# Altium project Steering.PrjPcb (part 2 of 2)

## Sheet Neopixel.SchDoc: =DocumentName
size A4; Organization: Queen's Formula SAE; Address1: 130 Stuart St, Kingston; Address2: Ontario; Address3: Canada; Address4: K7L 2V9; DocumentNumber: 1; Revision: 0; SheetNumber: 1; SheetTotal: 1
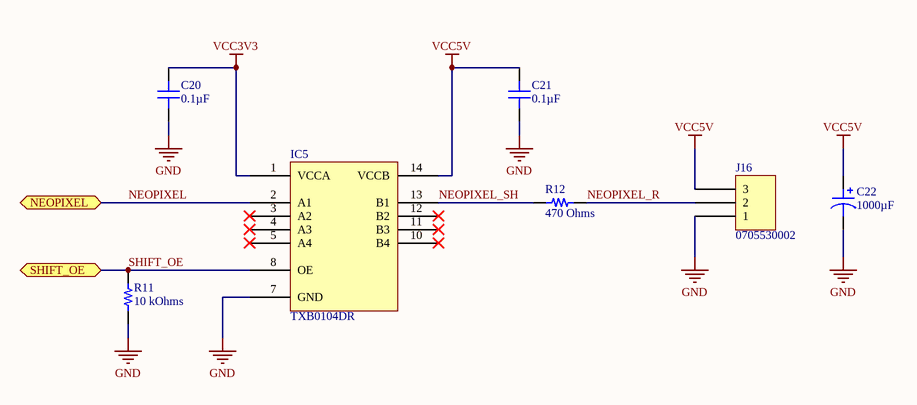
[diagram p5: Neopixel.SchDoc]

### Parts
C20  0.1µF  [CAP 0402_1005]
C21  0.1µF  [CAP 0402_1005]
C22  1000µF  [CAP ALSMD 8.3MM H10.5MM]
IC5  TXB0104DR  [TI SOIC-14 D]
J16  0705530002  [MOLEX SDA-70553-3PIN]
R11  10 kOhms  [RES 0402_1005]
R12  470 Ohms  [RES 0402_1005]

### Ports
NEOPIXEL (bidir), SHIFT_OE (bidir)

### Nets
GND: C20.1 C21.1 C22.2 IC5.7(GND) J16.1 R11.1
VCC3V3: C20.2 IC5.1(VCCA)
VCC5V: C21.2 C22.1 IC5.14(VCCB) J16.3
NEOPIXEL: IC5.2(A1) ; port NEOPIXEL
NEOPIXEL_R: J16.2 R12.2
NEOPIXEL_SH: IC5.13(B1) R12.1
SHIFT_OE: IC5.8(OE) R11.2 ; port SHIFT_OE

Not connected (* = marked no-connect by the designer): IC5 3(A2)* 4(A3)* 5(A4)* 10(B4)* 11(B3)* 12(B2)*

### Notes on the sheet
- Title
- Size:
- Date:
- A4
- Number:
- Time:
- Revision:
- Sheet
- of
- File:

### Library data of the parts
C20 C21 = C0402C104K4RECAUTO: CAP CER 0402 0.1UF 16V X7R 10%; Manufacturer: KEMET; Part Number: C0402C104K4RECAUTO; Value: 0.1µF; Applications: Automotive, ESD Protection; Capacitance: 0.1µF; ComponentLink1Description: Datasheet; ComponentLink1URL: https://api.kemet.com/component-edge/download/datasheet/C0402C104K4RECAUTO.pdf; ComponentLink2Description: DigiKey Link; ComponentLink2URL: http://digikey.com/product-detail/en/kemet/C0402C104K4RECAUTO/399-17167-1-ND/8563708; Device Package: 0402 (1005 Metric); LastUpdated: 2020-09-02 1:02:25 AM; Lifecycle Status: Active; Minimum Order: 1; Mounting Type: Surface Mount, MLCC; Operating Temperature: -55°C ~ 125°C; Package / Case: 0402 (1005 Metric); Packaging: TapeAndReel; PartId: 1731; Part Status: Active; Price: 0.02; Series: ESD SMD Auto X7R; Size / Dimension: 0.039" L x 0.020" W (1.00mm x 0.50mm); Supplier 1: DigiKey; Supplier Part Number 1: 399-17167-1-ND; Temperature Coefficient: X7R; Thickness (Max): 0.022" (0.55mm); Tolerance: ±10%; Voltage - Rated: 16V; Ratings: AEC-Q200
C22 = EEE-FT1A102AP: CAP ALUM 1000UF 20% 10V SMD; Manufacturer: Panasonic Electronic Components; ESR (Equivalent Series Resistance): 80mOhm @ 100kHz; Lifetime @ Temp.: 2000 Hrs @ 105°C; Polarization: Polar; Ripple Current @ High Frequency: 850mA @ 100kHz; Ripple Current @ Low Frequency: 595mA @ 120Hz; Surface Mount Land Size: 0.327" L x 0.327" W (8.30mm x 8.30mm); Part Number: EEE-FT1A102AP; Applications: Automotive; Capacitance: 1000µF; ComponentLink1Description: Datasheet; ComponentLink1URL: https://na.industrial.panasonic.com/file-download/3112; ComponentLink2Description: DigiKey Link; ComponentLink2URL: http://digikey.com/product-detail/en/panasonic-electronic-components/EEE-FT1A102AP/P15081CT-ND/2796921; Device Package: Radial, Can - SMD; Height - Seated (Max): 0.413" (10.50mm); LastUpdated: 2020-09-02 1:25:16 AM; Lifecycle Status: Active; Minimum Order: 1; Mounting Type: Surface Mount; Operating Temperature: -55°C ~ 105°C; Package / Case: Radial, Can - SMD; Packaging: TapeAndReel; PartId: 7500; Part Status: Active; Price: 0.33; Ratings: AEC-Q200; Series: FT; Size / Dimension: 0.315" Dia (8.00mm); Supplier 1: DigiKey; Supplier Part Number 1: P15081CT-ND; Tolerance: ±20%; Value: 1000µF; Voltage - Rated: 10V
IC5 = TXB0104DR: IC TRNSLTR BIDIRECTIONAL 14SOIC; Part Number: TXB0104DR
J16 = 0705530002: CONN HEADER R/A 3POS 2.54MM; Manufacturer: Molex; Contact Length - Mating: 0.240" (6.10mm); Contact Length - Post: 0.130" (3.30mm); Material Flammability Rating: UL94 V-0; Number of Positions: 3; Number of Positions Loaded: All; Pitch - Mating: 0.100" (2.54mm); Shrouding: Shrouded - 4 Wall; Style: Board to Cable/Wire; Voltage Rating: 250V; Part Number: 0705530002; ComponentLink1Description: Datasheet; ComponentLink1URL: https://www.molex.com/pdm_docs/sd/705530002_sd.pdf; ComponentLink2Description: DigiKey Link; ComponentLink2URL: http://digikey.com/product-detail/en/molex/0705530002/WM4901-ND/114955; Connector Type: Header; Contact Finish - Mating: Gold; Contact Finish - Post: Tin; Contact Finish Thickness - Mating: 15.0µin (0.38µm); Contact Material: Phosphor Bronze; Contact Shape: Square; Contact Type: Male Pin; Fastening Type: Latch Holder; Insulation Color: Black; Insulation Height: 0.215" (5.45mm); Insulation Material: Polyester, Glass Filled; LastUpdated: 2020-01-12 11:55:56 PM; Lifecycle Status: Active; Minimum Order: 1; Mounting Type: Through Hole, Right Angle; Number of Rows: 1; Operating Temperature: -40°C ~ 105°C; Packaging: Tube; PartId: 86; Part Status: Active; Price: 1.02; Series: SL 70553; Supplier 1: DigiKey; Supplier Part Number 1: WM4901-ND; Termination: Solder
R11 = CPF0402B10KE1: RES SMD 10K OHM 0.1% 1/16W 0402; Manufacturer: TE Connectivity Passive Product; Power (Watts): 0.063W, 1/16W; Temperature Coefficient: ±25ppm/°C; Part Number: CPF0402B10KE1; Value: 10 kOhms; ComponentLink1Description: Datasheet; ComponentLink1URL: https://www.te.com/commerce/DocumentDelivery/DDEController?Action=srchrtrv&DocNm=1773200&DocType=DS&DocLang=English; ComponentLink2Description: DigiKey Link; ComponentLink2URL: http://digikey.com/product-detail/en/te-connectivity-passive-product/CPF0402B10KE1/A102579CT-ND/2729112; Composition: Thin Film; Device Package: 0402 (1005 Metric); Height - Seated (Max): 0.014" (0.35mm); LastUpdated: 2020-09-02 1:07:41 AM; Lifecycle Status: Active; Minimum Order: 1; Number of Terminations: 2; Operating Temperature: -55°C ~ 155°C; Package / Case: 0402 (1005 Metric); Packaging: TapeAndReel; PartId: 15889; Part Status: Active; Price: 0.13; Resistance: 10 kOhms; Series: CPF, Neohm; Size / Dimension: 0.039" L x 0.020" W (1.00mm x 0.50mm); Supplier 1: DigiKey; Supplier Part Number 1: A102579CT-ND; Supplier Device Package: 0402; Tolerance: ±0.1%
R12 = RCS0402470RFKED: RES SMD 470 OHM 1% 1/5W 0402; Manufacturer: Vishay Dale; Power (Watts): 0.2W, 1/5W; Temperature Coefficient: ±100ppm/°C; Part Number: RCS0402470RFKED; Value: 470 Ohms; ComponentLink1Description: Datasheet; ComponentLink1URL: http://www.vishay.com/docs/20065/rcse3.pdf; ComponentLink2Description: DigiKey Link; ComponentLink2URL: http://digikey.com/product-detail/en/vishay-dale/RCS0402470RFKED/541-10412-1-ND/10059778; Composition: Thick Film; Device Package: 0402 (1005 Metric); Features: Automotive AEC-Q200, Pulse Withstanding; Height - Seated (Max): 0.016" (0.40mm); LastUpdated: 2020-09-02 1:08:02 AM; Lifecycle Status: Active; Minimum Order: 1; Number of Terminations: 2; Operating Temperature: -55°C ~ 155°C; Package / Case: 0402 (1005 Metric); Packaging: TapeAndReel; PartId: 6043; Part Status: Active; Price: 0.01; Ratings: AEC-Q200; Resistance: 470 Ohms; Series: RCS e3; Size / Dimension: 0.039" L x 0.020" W (1.00mm x 0.50mm); Supplier 1: DigiKey; Supplier Part Number 1: 541-10412-1-ND; Supplier Device Package: 0402; Tolerance: ±1%

## Nets that join several sheets
GND: Power (9 pins), MCU (22 pins), CAN (C5.1 C6.1 IC3.2), Connectors (13 pins), Neopixel (6 pins)
VCC3V3: Power (C4.2 IC2.5 R7.2), MCU (16 pins), CAN (C5.2 IC3.5), Connectors (8 pins), Neopixel (C20.2 IC5.1)
VCC5V: Power (7 pins), CAN (C6.2 IC3.3), Connectors (J3.1 J11.6 J11.7), Neopixel (C21.2 C22.1 IC5.14 J16.3)
VCC12V: Power (C1.2 IC1.3 R5.1), Connectors (J2.1)
BUTTON1: MCU (IC4.37), Connectors (J4.1 R1.1)
BUTTON2: MCU (IC4.25), Connectors (J6.1 R3.1)
BUTTON3: MCU (IC4.36), Connectors (J5.1 R2.1)
BUTTON4: MCU (IC4.24), Connectors (J7.1 R4.1)
CAN1_N: CAN (IC3.6), Connectors (J1.1)
CAN1_P: CAN (IC3.7 R8.1 S2.1), Connectors (J1.2)
CAN1_RX: MCU (IC4.44), CAN (IC3.4)
CAN1_STBY: MCU (IC4.43), CAN (IC3.8)
CAN1_TX: MCU (IC4.45), CAN (IC3.1)
DOWNSHIFT: MCU (IC4.29), Connectors (J15.2)
NEOPIXEL: MCU (IC4.55), Neopixel (IC5.2)
RPOT1: MCU (IC4.26), Connectors (J14.2)
RPOT2: MCU (IC4.27), Connectors (J13.2)
SHIFT_OE: MCU (IC4.56), Neopixel (IC5.8 R11.2)
SPI1_MISO: MCU (IC4.22), Connectors (J11.2)
SPI1_MOSI: MCU (IC4.23), Connectors (J11.1)
SPI1_NSS: MCU (IC4.20), Connectors (J11.4)
SPI1_SCK: MCU (IC4.21), Connectors (J11.3)
UPSHIFT: MCU (IC4.34), Connectors (J15.1)